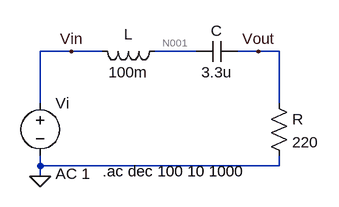
[diagram p0: schematic Draft16.asc]
Draft16.asc, the LTspice schematic file:
Version 4
SHEET 1 880 680
WIRE 112 64 64 64
WIRE 160 64 112 64
WIRE 304 64 240 64
WIRE 400 64 368 64
WIRE 432 64 400 64
WIRE 64 144 64 64
WIRE 432 144 432 64
WIRE 64 240 64 224
WIRE 432 240 432 224
WIRE 432 240 64 240
WIRE 64 256 64 240
FLAG 64 256 0
FLAG 112 64 Vin
FLAG 400 64 Vout
SYMBOL voltage 64 128 R0
WINDOW 123 24 124 Left 2
WINDOW 39 0 0 Left 0
SYMATTR InstName Vi
SYMATTR Value ""
SYMATTR Value2 AC 1
SYMBOL ind 256 48 R90
WINDOW 0 5 56 VBottom 2
WINDOW 3 32 56 VTop 2
SYMATTR InstName L
SYMATTR Value 100m
SYMBOL cap 368 48 R90
WINDOW 0 0 32 VBottom 2
WINDOW 3 32 32 VTop 2
SYMATTR InstName C
SYMATTR Value 3.3u
SYMBOL res 416 128 R0
SYMATTR InstName R
SYMATTR Value 220
SYMATTR SpiceLine tol=1 pwr=0.1
TEXT 160 248 Left 2 !.ac dec 100 10 1000

The netlist it stands for:
* Draft16.asc
Vi Vin 0 AC 1
L N001 Vin 100m
C Vout N001 3.3u
R Vout 0 220 tol=1 pwr=0.1
.ac dec 100 10 1000
.backanno
.end

* Results of the author's LTspice run, read from the files saved beside the schematic
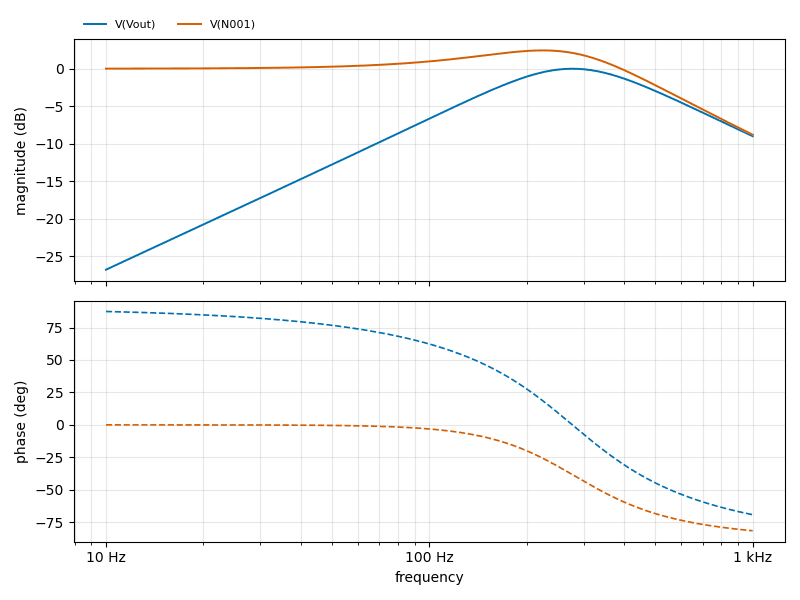
[diagram p1: AC Analysis of Draft16.asc, plotted from the saved traces]
* AC Analysis, 1 run:
*   V(Vout): -26.82 dB at 10 Hz, -9.01 dB at 1 kHz, peak -0.00 dB at 275.4 Hz, 3 dB below the peak at 152.7 Hz and 502.8 Hz
*   V(N001): 0.01 dB at 10 Hz, -8.80 dB at 1 kHz, peak 2.45 dB at 223.9 Hz, 3 dB below the peak at 418.6 Hz